# Altium schematic sheet POWER.SchDoc
size A4
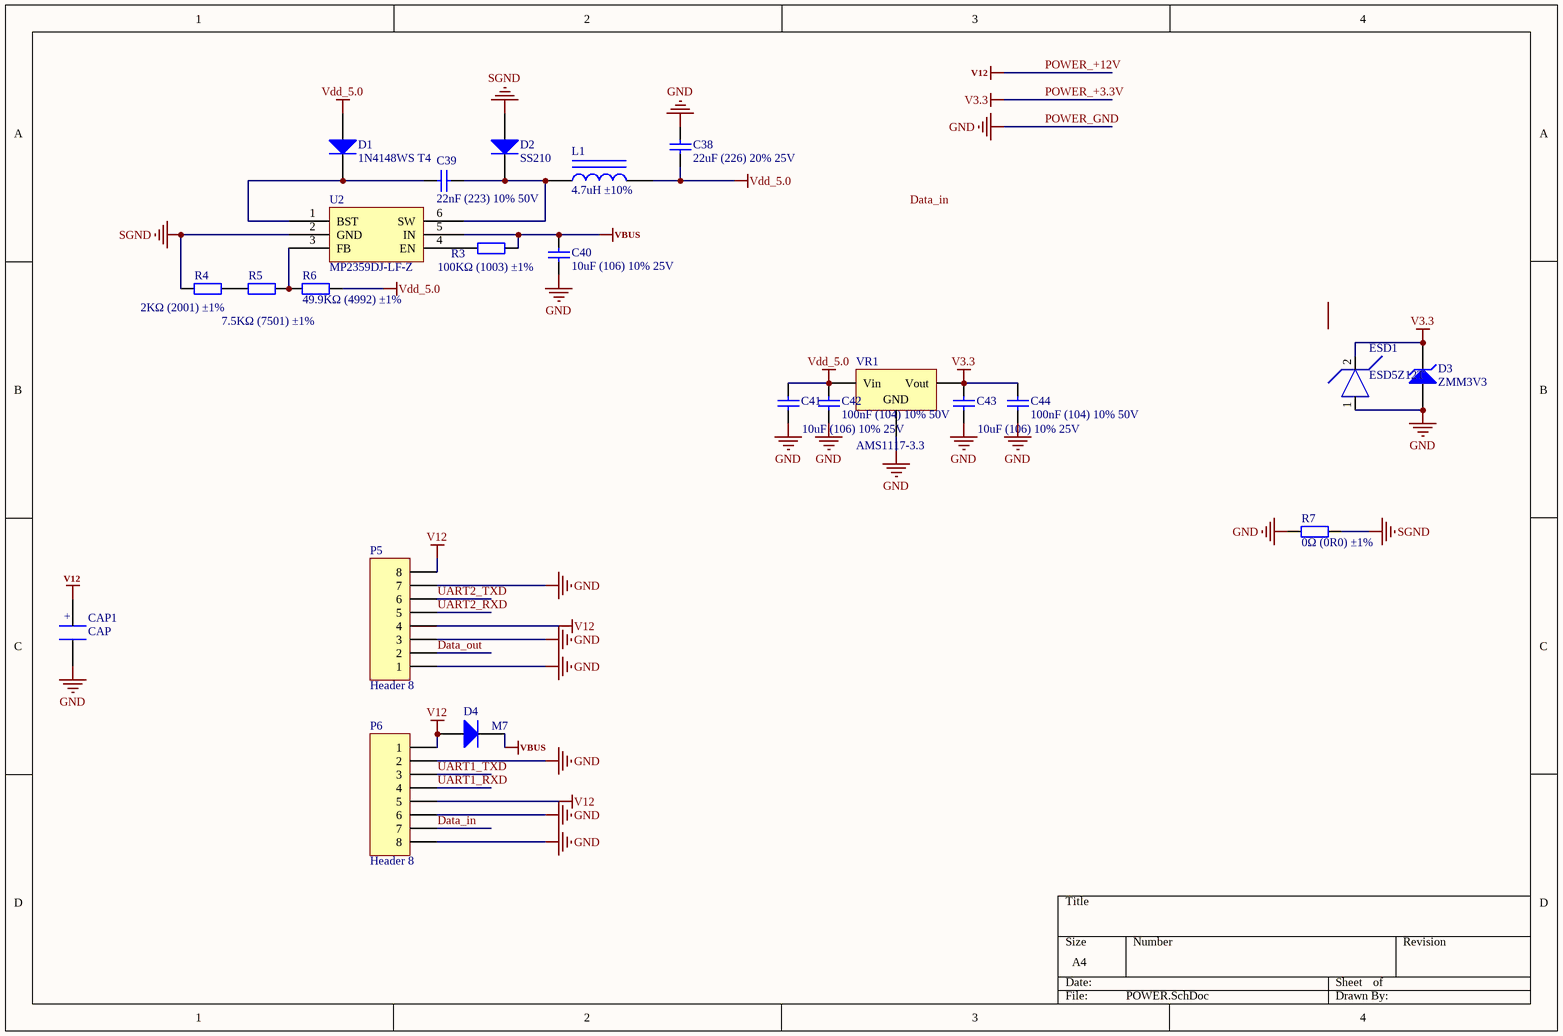
[diagram p0: POWER.SchDoc]

## Parts
C38  22uF (226) 20% 25V  [0805_C]
C39  22nF (223) 10% 50V  [0603_C]
C40  10uF (106) 10% 25V  [0805_C]
C41  10uF (106) 10% 25V  [0805_C]
C42  100nF (104) 10% 50V  [0603_C]
C43  10uF (106) 10% 25V  [0805_C]
C44  100nF (104) 10% 50V  [0603_C]
CAP1  CAP  [8X12_CAP]
D1  1N4148WS T4  [SOD-323]
D2  SS210  [SMA(DO-214AC)_S1]
D3  ZMM3V3  [LL-34]
D4  M7  [SMA(DO-214AC)_S1]
ESD1  ESD5Z12T  [SOD-523]
L1  4.7uH ±10%  [L_4030]
P5  Header 8  [FPC1.0-2H-WS-8P]
P6  Header 8  [FPC1.0-2H-WS-8P]
R3  100KΩ (1003) ±1%  [0603_R]
R4  2KΩ (2001) ±1%  [0603_R]
R5  7.5KΩ (7501) ±1%  [0603_R]
R6  49.9KΩ (4992) ±1%  [0603_R]
R7  0Ω (0R0) ±1%  [0603_R]
U2  MP2359DJ-LF-Z  [SOT-23-6]
VR1  AMS1117-3.3  [SOT-223]

## Nets
POWER_+3.3V: C43.2 C44.2 D3.2(K) ESD1.2 VR1.2(Vout)  [also labelled V3.3]
POWER_+12V: CAP1.1 D4.1(A) P5.4 P5.8 P6.1 P6.5  [also labelled V12]
POWER_GND: C38.2 C40.1 C41.1 C42.1 C43.1 C44.1 CAP1.2 D3.1(A) ESD1.1 P5.1 P5.3 P5.7 P6.2 P6.6 P6.8 R7.1 VR1.1(GND)  [also labelled GND]
SGND: D2.1(A) R4.2 R7.2 U2.2(GND)
VBUS: C40.2 D4.2(K) R3.2 U2.5(IN)
Vdd_5.0: C38.1 C41.2 C42.2 D1.1(A) L1.2 R6.2 VR1.3(Vin)
Data_in: P6.7
Data_out: P5.2
UART1_RXD: P6.4
UART1_TXD: P6.3
UART2_RXD: P5.5
UART2_TXD: P5.6
NetC39_1: C39.1 D1.2(K) U2.1(BST)
NetC39_2: C39.2 D2.2(K) L1.1 U2.6(SW)
NetR3_1: R3.1 U2.4(EN)
NetR4_1: R4.1 R5.2
NetR5_1: R5.1 R6.1 U2.3(FB)

## Notes on the sheet
- Labels drawn without touching a wire or pin: Data_in
- (in symbol CAP) +

## Library data of the parts
C38 = 0805 22uF (226) 20% 25V: 贴片电容; ComponentLink1Description: 供应商链接; ComponentLink1URL: http://www.szlcsc.com/product/details_46786.html; Package: 0805; Supplier: LC; SuppliersPartNumber: C45783
C39 = 0603 22nF (223) 10% 50V: 贴片电容; ComponentLink1Description: 供应商链接; ComponentLink1URL: http://www.szlcsc.com/product/details_21834.html; Package: 0603; Supplier: LC; SuppliersPartNumber: C21122
C40 C41 C43 = 0805 10uF (106) 10% 25V: 贴片电容; ComponentLink1Description: 供应商链接; ComponentLink1URL: http://www.szlcsc.com/product/details_16532.html; Package: 0805; Supplier: LC; SuppliersPartNumber: C15850
C42 C44 = 0603 100nF (104) 10% 50V: 贴片电容; ComponentLink1Description: 供应商链接; ComponentLink1URL: http://www.szlcsc.com/product/details_15331.html; Package: 0603; Supplier: LC; SuppliersPartNumber: C14663
D1 = SOD-323 1N4148WS T4: 二极管; ComponentLink1Description: 供应商链接; ComponentLink1URL: http://www.szlcsc.com/product/details_2485.html; Package: SOD-323; Supplier: LC; SuppliersPartNumber: C2128
D2 = SMA(DO-214AC) SS210: 二极管; ComponentLink1Description: 供应商链接; ComponentLink1URL: http://www.szlcsc.com/product/details_15669.html; Package: SMA(DO-214AC); Supplier: LC; SuppliersPartNumber: C14996
D3 = LL-34 ZMM3V3: 稳压二极管; ComponentLink1Description: 供应商链接; ComponentLink1URL: http://www.szlcsc.com/product/details_8535.html; Package: LL-34; Supplier: LC; SuppliersPartNumber: C8056
D4 = SMA(DO-214AC) M7: 二极管; 备注: 1N4007 4007 编号C2464 已经停售, 使用新物料编号C95872; ComponentLink1Description: 供应商链接; ComponentLink1URL: http://www.szlcsc.com/product/details_2841.html; Package: SMA(DO-214AC); Supplier: LC; SuppliersPartNumber: C95872
ESD1 = ESD-D
L1 = 0603 4.7uH 10%: 贴片电感; ComponentLink1Description: 供应商链接; ComponentLink1URL: http://www.szlcsc.com/product/details_1386.html; Package: 0603; Supplier: LC; SuppliersPartNumber: C1034
P5 P6 = Header 8: Header, 8-Pin; LatestRevisionDate: 17-Jul-2002; LatestRevisionNote: Re-released for DXP Platform.; Publisher: Altium Limited
R3 = 0603 100KΩ (1003) 1%: 贴片电阻; ComponentLink1Description: 供应商链接; ComponentLink1URL: http://www.szlcsc.com/product/details_26546.html; Package: 0603; Supplier: LC; SuppliersPartNumber: C25803
R4 = 0603 2KΩ (2001) 1%: 贴片电阻; ComponentLink1Description: 供应商链接; ComponentLink1URL: http://www.szlcsc.com/product/details_23702.html; Package: 0603; Supplier: LC; SuppliersPartNumber: C22975
R5 = 0603 7.5KΩ (7501) 1%: 贴片电阻; ComponentLink1Description: 供应商链接; ComponentLink1URL: http://www.szlcsc.com/product/details_23961.html; Package: 0603; Supplier: LC; SuppliersPartNumber: C23234
R6 = 0603 49.9KΩ (4992) 1%: 贴片电阻; ComponentLink1Description: 供应商链接; ComponentLink1URL: http://www.szlcsc.com/product/details_23911.html; Package: 0603; Supplier: LC; SuppliersPartNumber: C23184
R7 = 0603 0Ω (0R0) 1%: 贴片电阻; ComponentLink1Description: 供应商链接; ComponentLink1URL: http://www.szlcsc.com/product/details_21903.html; Package: 0603; Supplier: LC; SuppliersPartNumber: C21189
U2 = MP2359DJ-LF-Z_[C14259]: DC-DC芯片; ComponentLink1Description: 供应商链接; ComponentLink1URL: http://www.szlcsc.com/product/details_14917.html; Package: SOT-23-6; Supplier: LC; SuppliersPartNumber: C14259
VR1 = SOT-223 AMS1117-3.3: 低压差线性稳压(LDO); ComponentLink1Description: 供应商链接; ComponentLink1URL: http://www.szlcsc.com/product/details_6652.html; Package: SOT-223; Supplier: LC; SuppliersPartNumber: C6186